# EAGLE schematic PastMontFIX (EAGLE 9.5.1)
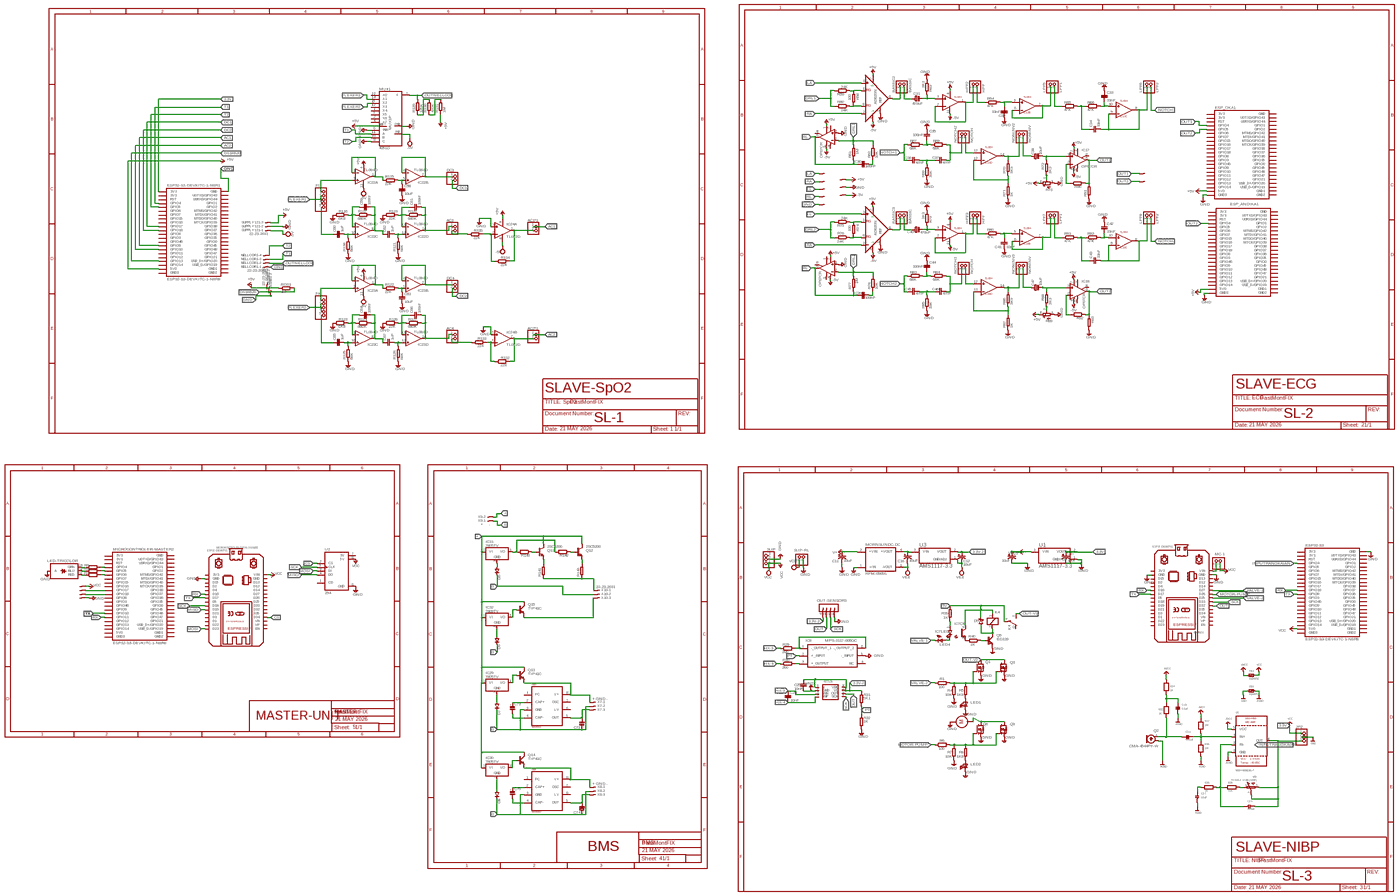
[diagram p0: schematic, sheet 1, overview]
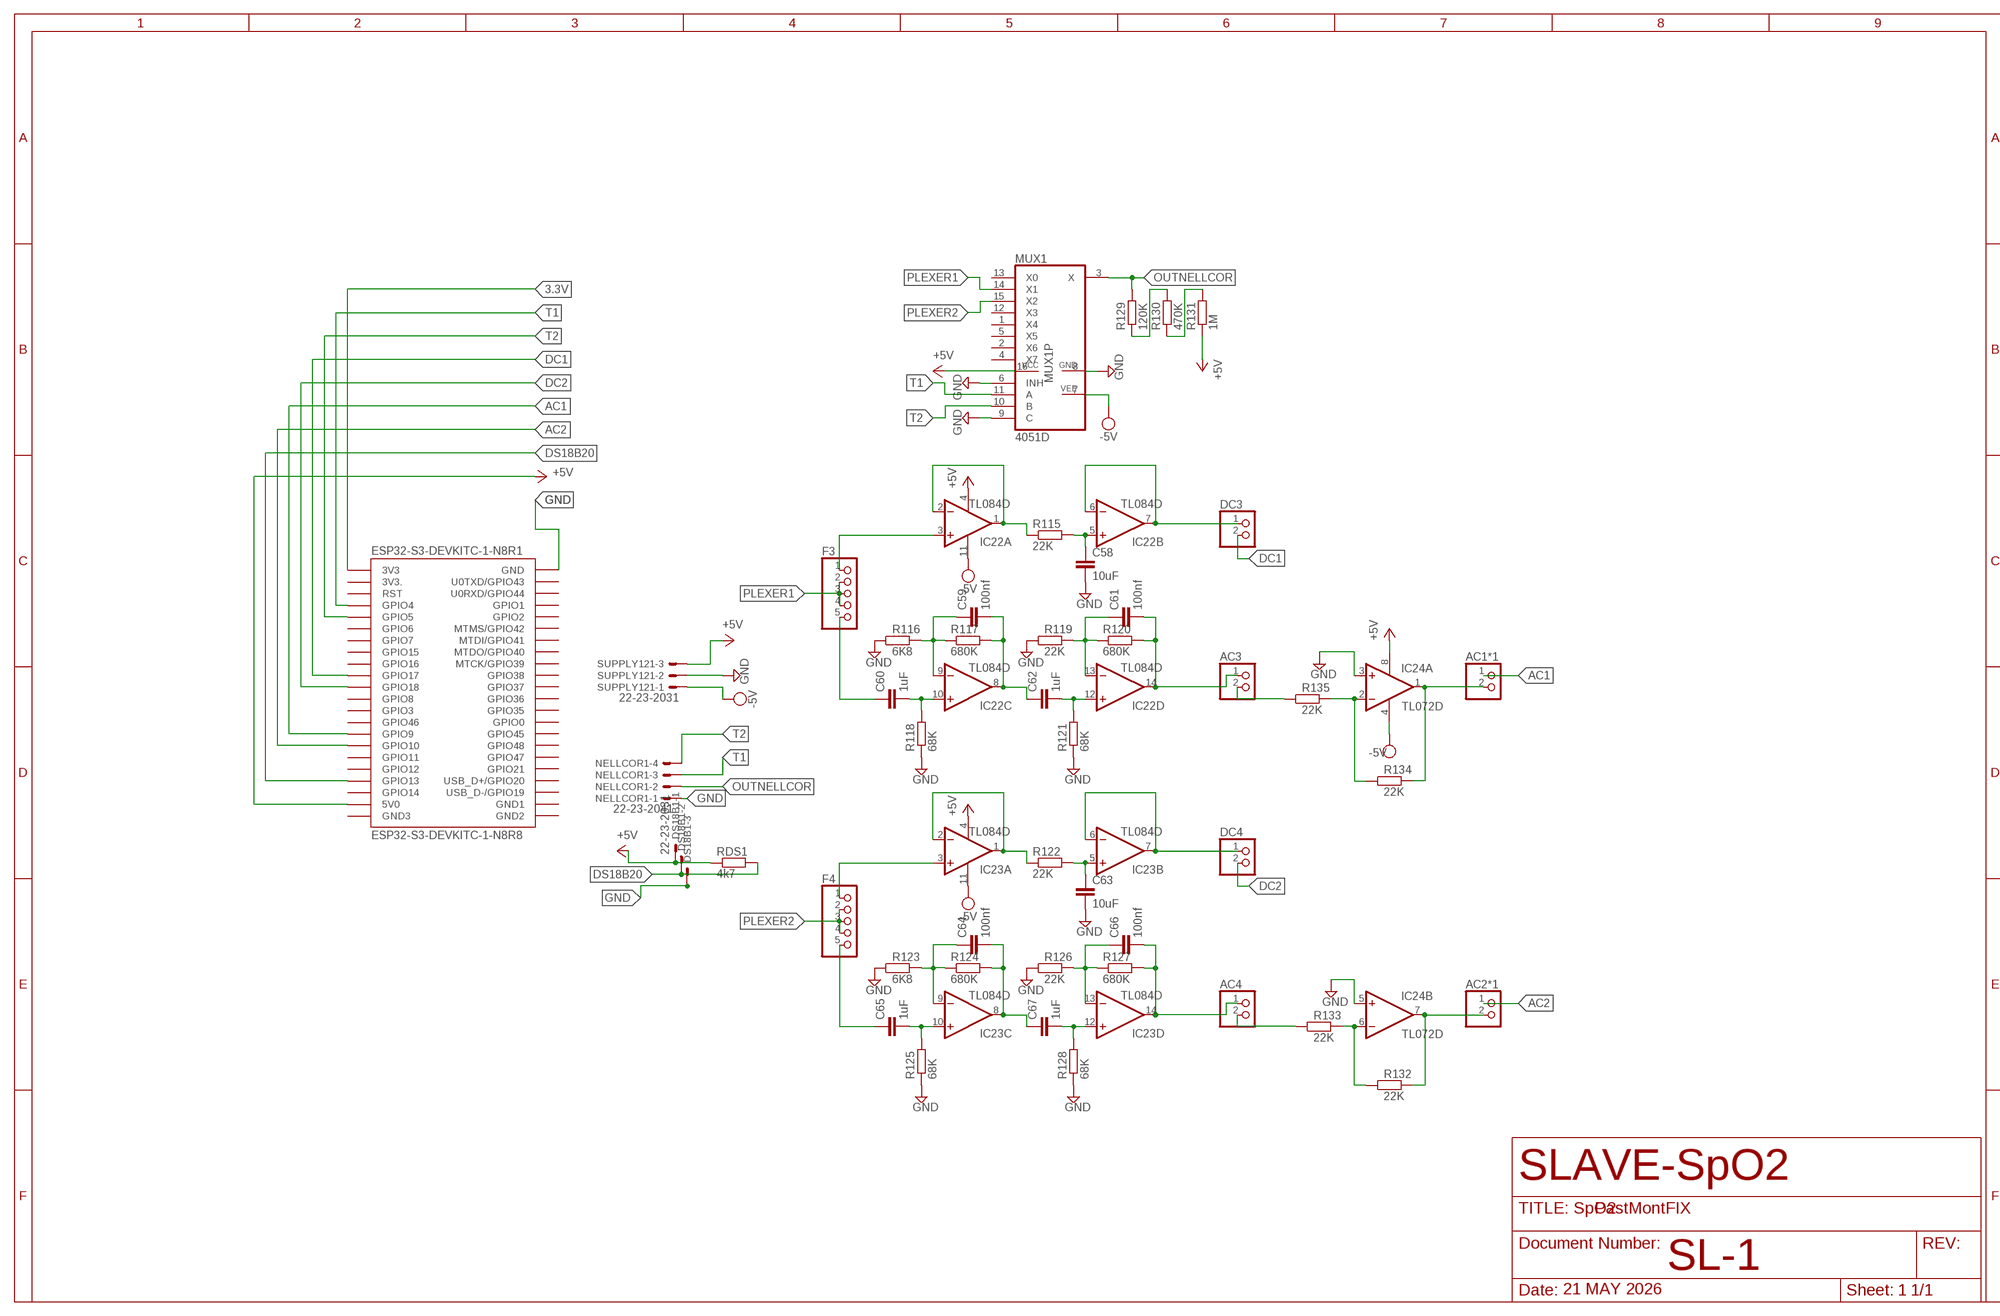
[diagram p1: schematic, sheet 1, part 1 of 4]
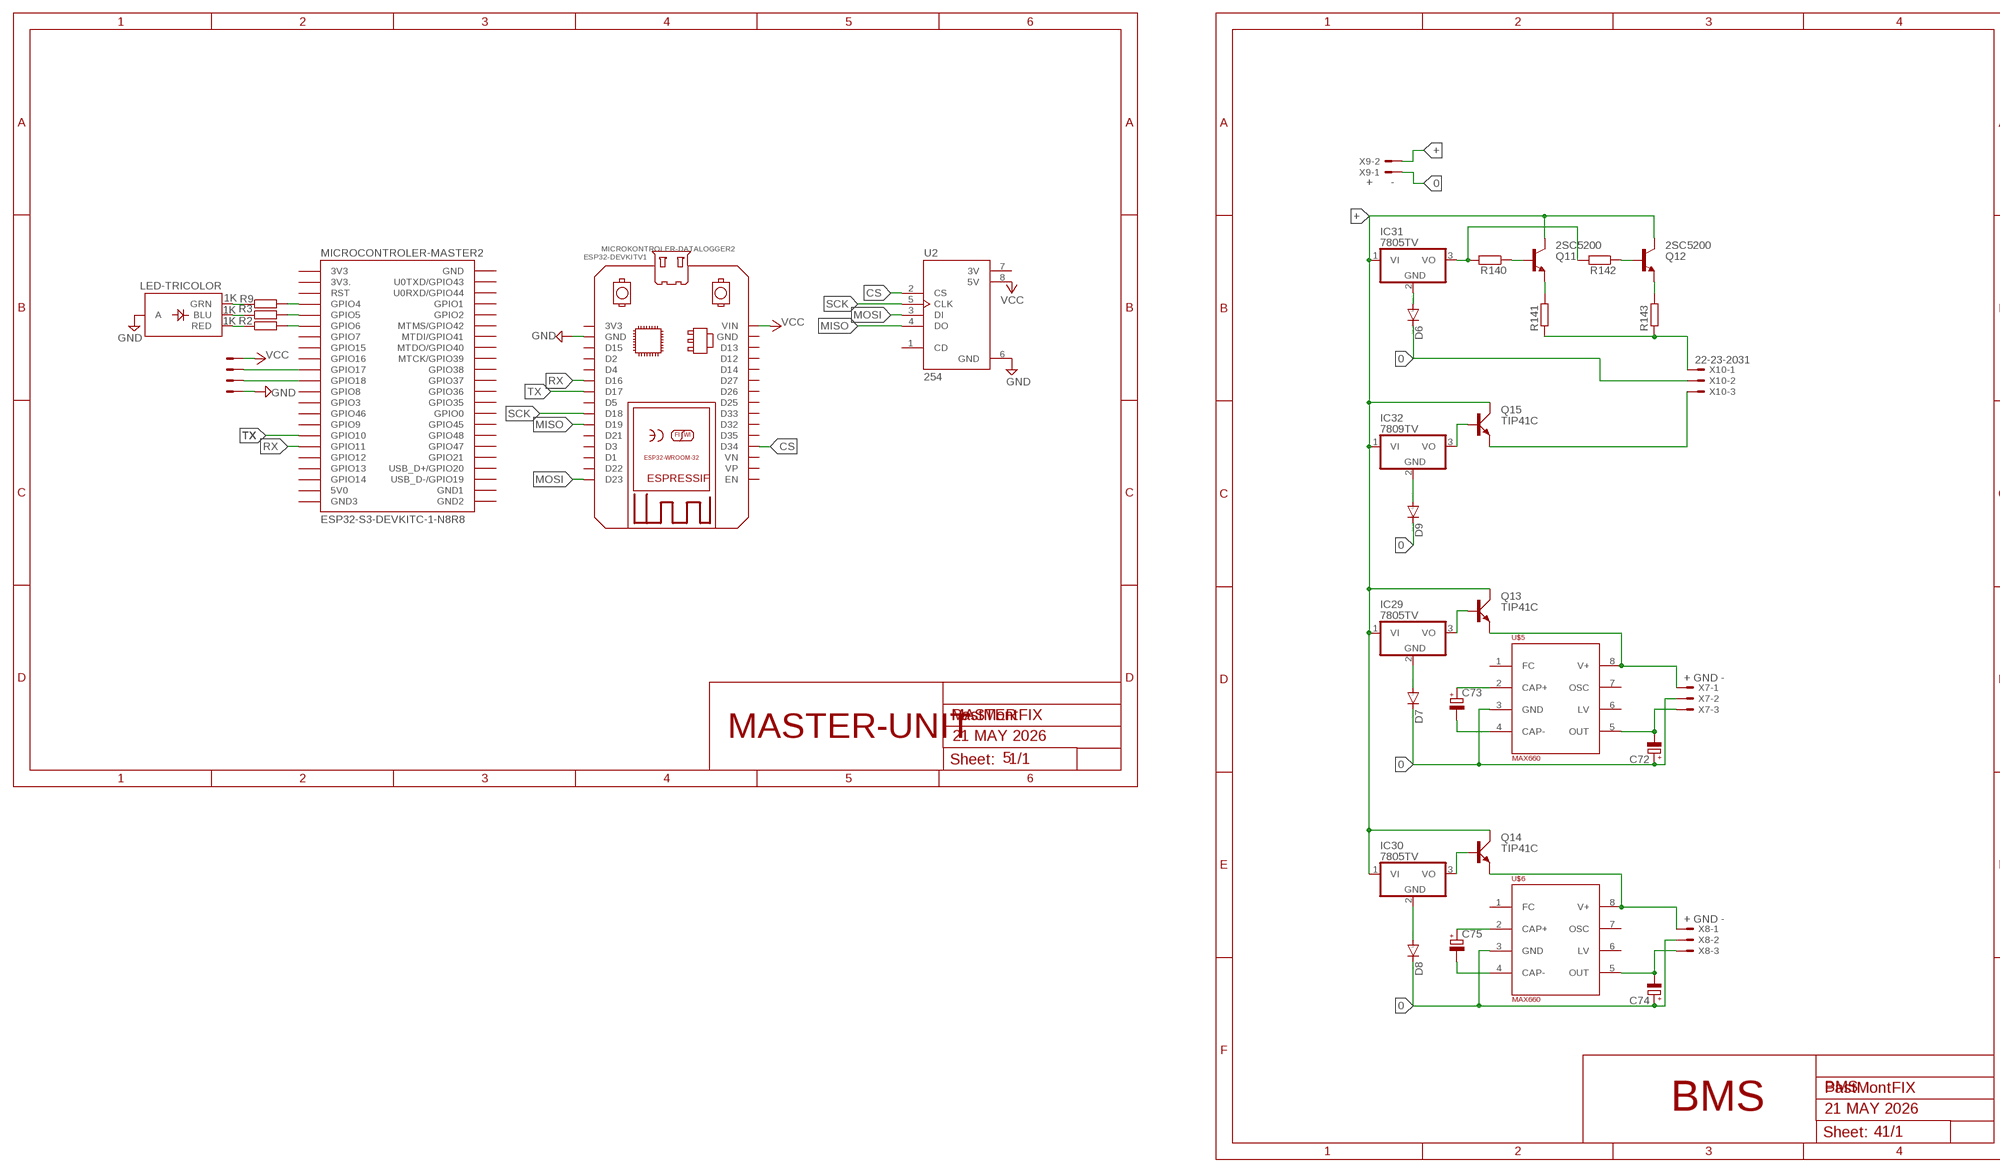
[diagram p2: schematic, sheet 1, part 2 of 4]
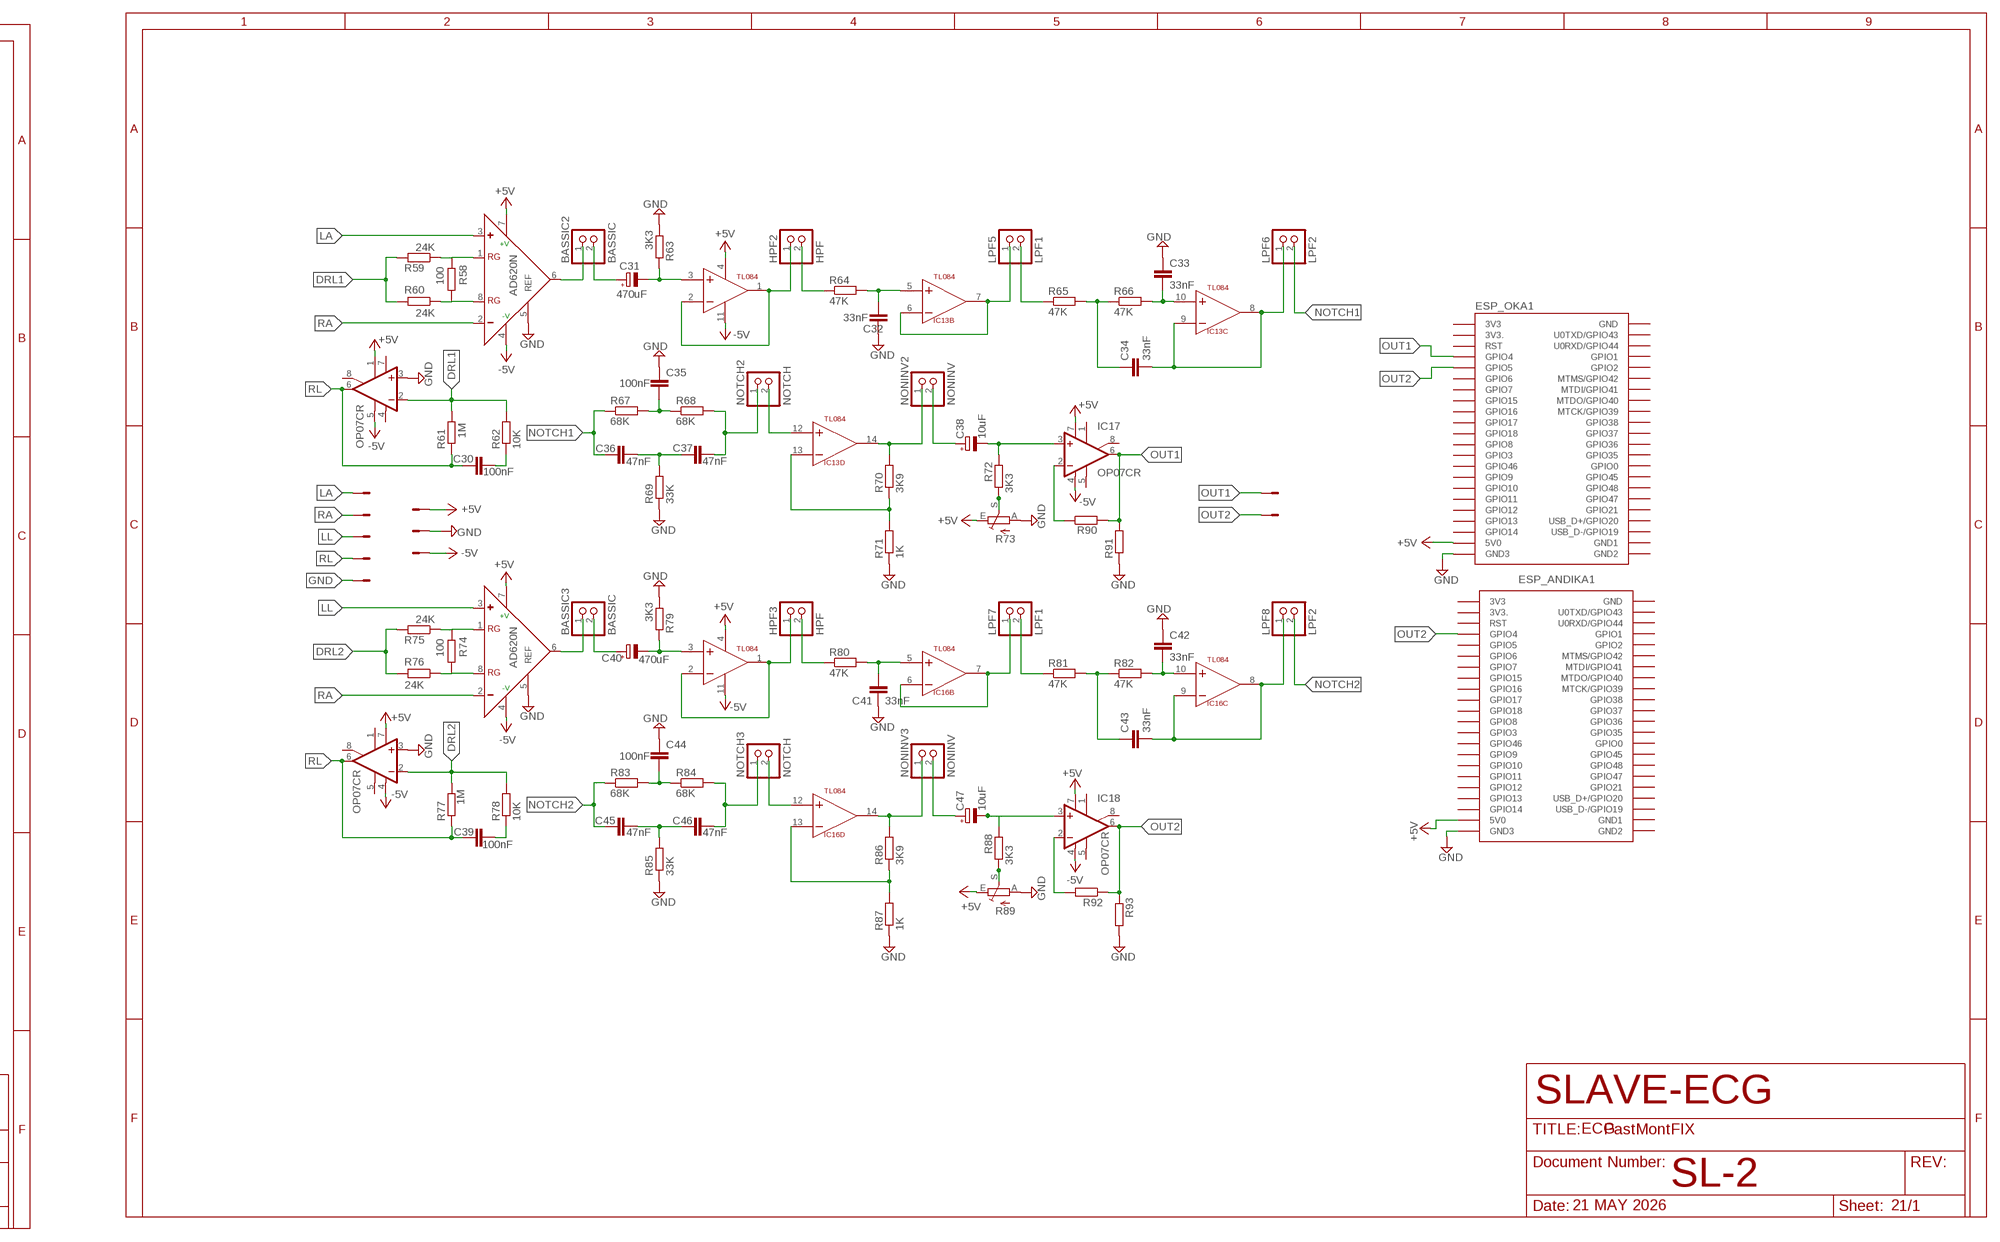
[diagram p3: schematic, sheet 1, part 3 of 4]
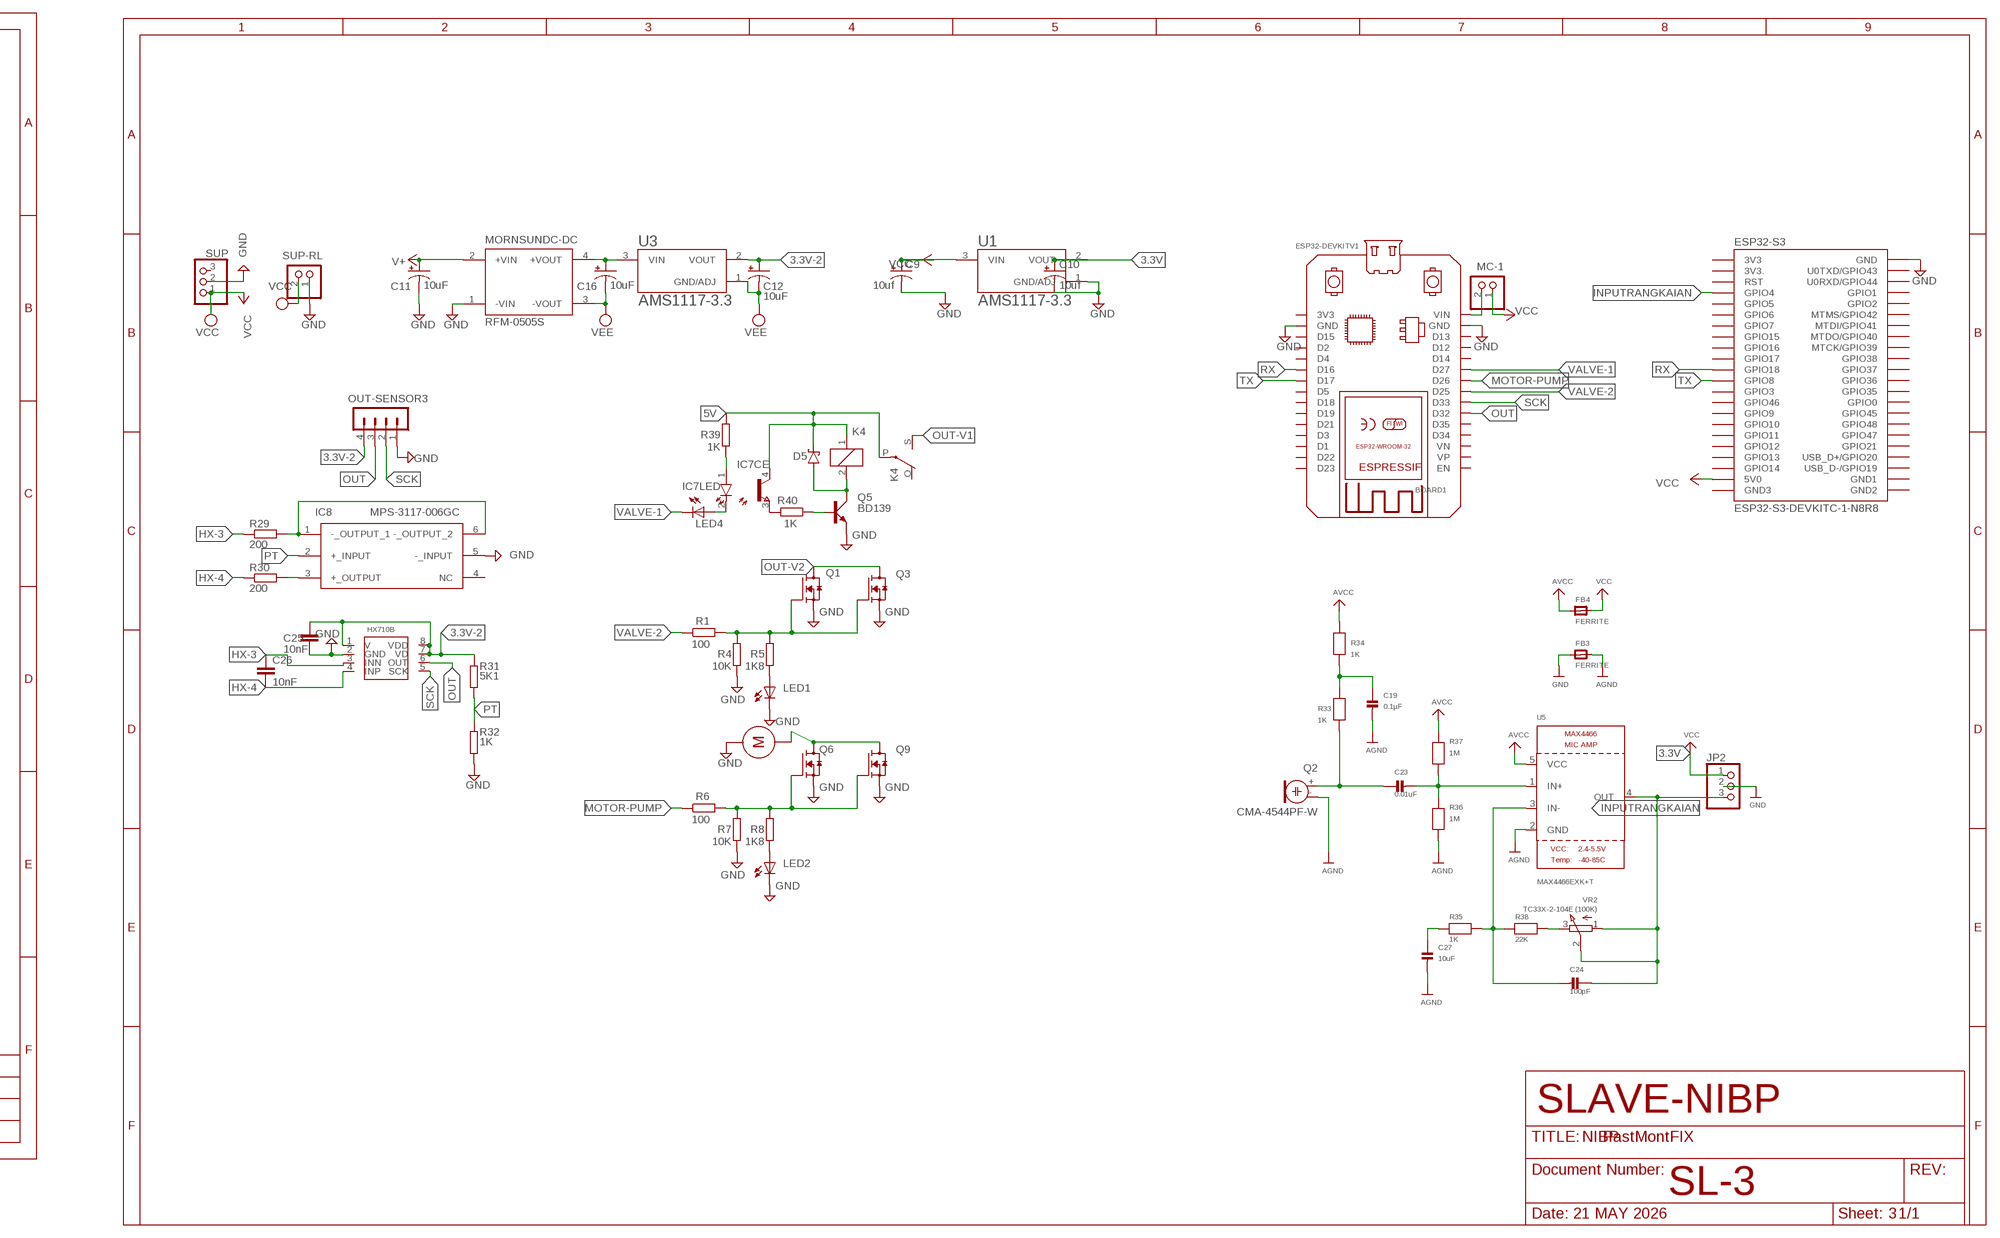
[diagram p4: schematic, sheet 1, part 4 of 4]

## Parts
AC1*1  PINHD-1X2  [1X02]
AC2*1  PINHD-1X2  [1X02]
AC3  PINHD-1X2  [1X02]
AC4  PINHD-1X2  [1X02]
BASSIC2  BASSIC  PINHD-1X2  [1X02]
BASSIC3  BASSIC  PINHD-1X2  [1X02]
BOARD1  ESP32DEVKITV1  [ESP32-DEVKITV1]
C9  10uf  CPOL-US150CLZ-0810  [150CLZ-0810]
C10  10uf  CPOL-US150CLZ-0810  [150CLZ-0810]
C11  10uF  CPOL-US150CLZ-1014  [150CLZ-1014]
C12  10uF  CPOL-US150CLZ-1014  [150CLZ-1014]
C16  10uF  CPOL-US150CLZ-1014  [150CLZ-1014]
C19  0.1µF  CAP_CERAMIC0805  [0805]
C23  0.01uF  CAP_CERAMIC0805  [0805]
C24  100pF  CAP_CERAMIC0805  [0805]
C25  10nF  C-EUC1206  [C1206]
C26  10nF  C-EUC1206  [C1206]
C27  10uF  CAP_CERAMIC0805  [0805]
C30  100nF  C-EUC1206  [C1206]
C31  470uF  CPOL-EU150CLZ-1010  [150CLZ-1010]
C32  33nF  C-EUC1206  [C1206]
C33  33nF  C-EUC1206  [C1206]
C34  33nF  C-EUC1206  [C1206]
C35  100nF  C-EUC1206  [C1206]
C36  47nF  C-EUC1206  [C1206]
C37  47nF  C-EUC1206  [C1206]
C38  10uF  CPOL-EU150CLZ-0810  [150CLZ-0810]
C39  100nF  C-EUC1206  [C1206]
C40  470uF  CPOL-EU150CLZ-1010  [150CLZ-1010]
C41  33nF  C-EUC1206  [C1206]
C42  33nF  C-EUC1206  [C1206]
C43  33nF  C-EUC1206  [C1206]
C44  100nF  C-EUC1206  [C1206]
C45  47nF  C-EUC1206  [C1206]
C46  47nF  C-EUC1206  [C1206]
C47  10uF  CPOL-EU150CLZ-0810  [150CLZ-0810]
C58  10uF  C-EUC1206  [C1206]
C59  100nf  C-EUC1206  [C1206]
C60  1uF  C-EUC1206  [C1206]
C61  100nf  C-EUC1206  [C1206]
C62  1uF  C-EUC1206  [C1206]
C63  10uF  C-EUC1206  [C1206]
C64  100nf  C-EUC1206  [C1206]
C65  1uF  C-EUC1206  [C1206]
C66  100nf  C-EUC1206  [C1206]
C67  1uF  C-EUC1206  [C1206]
C72  CPOL-EU150CLZ-0810  [150CLZ-0810]
C73  CPOL-EU150CLZ-0810  [150CLZ-0810]
C74  CPOL-EU150CLZ-0810  [150CLZ-0810]
C75  CPOL-EU150CLZ-0810  [150CLZ-0810]
D5  MBRS130LT3  [SMB]
D6  DIODE-DO41-7.6  [DO41-7.6]
D7  DIODE-DO41-7.6  [DO41-7.6]
D8  DIODE-DO41-7.6  [DO41-7.6]
D9  DIODE-DO41-7.6  [DO41-7.6]
DC3  PINHD-1X2  [1X02]
DC4  PINHD-1X2  [1X02]
DS18B1  22-23-2031  [22-23-2031]
ESP32-S3  ESP32-S3-DEVKITC-1-N8R8  [ESP32-S3-DEVKITC-1-N8R8]
ESP32-S3-DEVKITC-1-N8R1  ESP32-S3-DEVKITC-1-N8R8  [ESP32-S3-DEVKITC-1-N8R8]
ESP_ANDIKA1  ESP32-S3-DEVKITC-1-N8R8  [ESP32-S3-DEVKITC-1-N8R8]
ESP_OKA1  EWE  ESP32-S3-DEVKITC-1-N8R8  [ESP32-S3-DEVKITC-1-N8R8]
F3  PINHD-1X5  [1X05]
F4  PINHD-1X5  [1X05]
FB3  FERRITE  FERRITE0805  [0805]
FB4  FERRITE  FERRITE0805  [0805]
HPF2  HPF  PINHD-1X2  [1X02]
HPF3  HPF  PINHD-1X2  [1X02]
HX710B  HX710B  [SOP-8]
IC7  SFH6156  [SFH]
IC8  MPS-3117-006GC  [MPS3117006GC]
IC11  AD620N  [DIL08]
IC12  OP07CR  [SO08]
IC13  TL084  [SO14]
IC14  AD620N  [DIL08]
IC15  OP07CR  [SO08]
IC16  TL084  [SO14]
IC17  OP07CR  [SO08]
IC18  OP07CR  [SO08]
IC22  TL084D  [SO14]
IC23  TL084D  [SO14]
IC24  TL072D  [SO08]
IC29  7805TV  [TO220V]
IC30  7805TV  [TO220V]
IC31  7805TV  [TO220V]
IC32  7809TV  7805TV  [TO220V]
JP2  HEADER-1X376MIL  [1X03_ROUND_76]
K4  ZF112  [ZF112]
LED1  LEDCHIPLED_1206  [CHIPLED_1206]
LED2  LEDCHIPLED_1206  [CHIPLED_1206]
LED4  LEDCHIPLED_1206  [CHIPLED_1206]
LPF5  LPF1  PINHD-1X2  [1X02]
LPF6  LPF2  PINHD-1X2  [1X02]
LPF7  LPF1  PINHD-1X2  [1X02]
LPF8  LPF2  PINHD-1X2  [1X02]
M1  308-100  [308-100]
MC-1  PINHD-1X2  [1X02]
MICROCONTROLER-MASTER2  ESP32-S3-DEVKITC-1-N8R8  [ESP32-S3-DEVKITC-1-N8R8]
MICROKONTROLER-DATALOGGER2  ESP32DEVKITV1  [ESP32-DEVKITV1]
MORNSUNDC-DC  RFM-0505S  [CONV_RFM-0505S]
MUX1  4051D  [SO16]
NELLCOR1  22-23-2041  [22-23-2041]
NEX  22-23-2041  [22-23-2041]
NONINV2  NONINV  PINHD-1X2  [1X02]
NONINV3  NONINV  PINHD-1X2  [1X02]
NOTCH2  NOTCH  PINHD-1X2  [1X02]
NOTCH3  NOTCH  PINHD-1X2  [1X02]
OUT1  22-23-2021  [22-23-2021]
OUT-SENSOR3  MA04-1  [MA04-1]
POWER1  22-23-2031  [22-23-2031]
Q1  AOD4184A  [DPAK228P994X240-4N]
Q2  CMA-4544PF-W  ELECTRET  [ELECTRET_9.7]
Q3  AOD4184A  [DPAK228P994X240-4N]
Q5  BD139  [TO126AV]
Q6  AOD4184A  [DPAK228P994X240-4N]
Q9  AOD4184A  [DPAK228P994X240-4N]
Q11  2SC5200  [TO545P2020X520X2910-3]
Q12  2SC5200  [TO545P2020X520X2910-3]
Q13  TIP41C  [TO220AV]
Q14  TIP41C  [TO220AV]
Q15  TIP41C  [TO220AV]
R1  100  R-EU_M1206  [M1206]
R2  1K  R-EU_M1206  [M1206]
R3  1K  R-EU_M1206  [M1206]
R4  10K  R-EU_M1206  [M1206]
R5  1K8  R-EU_M1206  [M1206]
R6  100  R-EU_M1206  [M1206]
R7  10K  R-EU_M1206  [M1206]
R8  1K8  R-EU_M1206  [M1206]
R9  1K  R-EU_M1206  [M1206]
R29  200  R-EU_M1206  [M1206]
R30  200  R-EU_M1206  [M1206]
R31  5K1  R-EU_M1206  [M1206]
R32  1K  R-EU_M1206  [M1206]
R33  1K  RESISTOR0805  [0805]
R34  1K  RESISTOR0805  [0805]
R35  1K  RESISTOR0805  [0805]
R36  1M  RESISTOR0805  [0805]
R37  1M  RESISTOR0805  [0805]
R38  22K  RESISTOR0805  [0805]
R39  1K  R-EU_M1206  [M1206]
R40  1K  R-EU_M1206  [M1206]
R58  100  R-EU_R1206  [R1206]
R59  24K  R-EU_R1206  [R1206]
R60  24K  R-EU_R1206  [R1206]
R61  1M  R-EU_R1206  [R1206]
R62  10K  R-EU_R1206  [R1206]
R63  3K3  R-EU_R1206  [R1206]
R64  47K  R-EU_R1206  [R1206]
R65  47K  R-EU_R1206  [R1206]
R66  47K  R-EU_R1206  [R1206]
R67  68K  R-EU_R1206  [R1206]
R68  68K  R-EU_R1206  [R1206]
R69  33K  R-EU_R1206  [R1206]
R70  3K9  R-EU_R1206  [R1206]
R71  1K  R-EU_R1206  [R1206]
R72  3K3  R-EU_R1206  [R1206]
R73  TRIM_EU-CA6V  [CA6V]
R74  100  R-EU_R1206  [R1206]
R75  24K  R-EU_R1206  [R1206]
R76  24K  R-EU_R1206  [R1206]
R77  1M  R-EU_R1206  [R1206]
R78  10K  R-EU_R1206  [R1206]
R79  3K3  R-EU_R1206  [R1206]
R80  47K  R-EU_R1206  [R1206]
R81  47K  R-EU_R1206  [R1206]
R82  47K  R-EU_R1206  [R1206]
R83  68K  R-EU_R1206  [R1206]
R84  68K  R-EU_R1206  [R1206]
R85  33K  R-EU_R1206  [R1206]
R86  3K9  R-EU_R1206  [R1206]
R87  1K  R-EU_R1206  [R1206]
R88  3K3  R-EU_R1206  [R1206]
R89  TRIM_EU-CA6V  [CA6V]
R90  R-EU_R1206  [R1206]
R91  R-EU_R1206  [R1206]
R92  R-EU_R1206  [R1206]
R93  R-EU_R1206  [R1206]
R115  22K  R-EU_R1206  [R1206]
R116  6K8  R-EU_R1206  [R1206]
R117  680K  R-EU_R1206  [R1206]
R118  68K  R-EU_R1206  [R1206]
R119  22K  R-EU_R1206  [R1206]
R120  680K  R-EU_R1206  [R1206]
R121  68K  R-EU_R1206  [R1206]
R122  22K  R-EU_R1206  [R1206]
R123  6K8  R-EU_R1206  [R1206]
R124  680K  R-EU_R1206  [R1206]
R125  68K  R-EU_R1206  [R1206]
R126  22K  R-EU_R1206  [R1206]
R127  680K  R-EU_R1206  [R1206]
R128  68K  R-EU_R1206  [R1206]
R129  120K  R-EU_R1206  [R1206]
R130  470K  R-EU_R1206  [R1206]
R131  1M  R-EU_R1206  [R1206]
R132  22K  R-EU_R1206  [R1206]
R133  22K  R-EU_R1206  [R1206]
R134  22K  R-EU_R1206  [R1206]
R135  22K  R-EU_R1206  [R1206]
R140  R-EU_0617/17  [0617/17]
R141  R-EU_0922/22  [0922/22]
R142  R-EU_0617/17  [0617/17]
R143  R-EU_0922/22  [0922/22]
RDS1  4k7  R-EU_R1206  [R1206]
SUP  PINHD-1X3  [1X03]
SUP-RL  PINHD-1X2  [1X02]
SUPPLY121  22-23-2031  [22-23-2031]
U1  AMS1117-3.3  [SOT229P700X180-4N]
U2  254  [MODULE_254]
U3  AMS1117-3.3  [SOT229P700X180-4N]
U5  MAX4466EXK+T  MAX4466""  [SC70-5]
U$2  LED-TRICOLOR  [LED-TRICOLOR-SMD]
U$5  MAX660  [SO08]
U$6  MAX660  [SO08]
VR2  TC33X-2-104E (100K)  TRIMPOTTC33X-2  [TRIMPOT_BOURNS_TC33X-2]
X2  22-23-2051  [22-23-2051]
X7  + GND -  22-23-2031  [22-23-2031]
X8  + GND -  22-23-2031  [22-23-2031]
X9  + -  22-23-2021  [22-23-2021]
X10  22-23-2031  [22-23-2031]

## Nets
0: C72.+ C74.+ D6.C D7.C D8.C D9.C U$5.3(GND) U$6.3(GND) X7.2 X8.2 X9.1 X10.2
3.3V: C10.+ ESP32-S3-DEVKITC-1-N8R1.J1_1(3V3) JP2.1 U1.2(VOUT) ; supply symbol labelled VCC
3.3V-2: C12.+ C25.1 HX710B.1(V) HX710B.7(VD) HX710B.8(VDD) OUT-SENSOR3.4 R31.1 U3.2(VOUT)
5V: D5.C IC7.4(CE:C) K4.1 K4.P(2:P) R39.2
+: IC29.1(VI) IC30.1(VI) IC31.1(VI) IC32.1(VI) Q11.2(C) Q12.2(C) Q13.C Q14.C Q15.C X9.2
+5V: ESP_ANDIKA1.J1_21(5V0) ESP_OKA1.J1_21(5V0) IC11.4(-V) IC11.7(+V) IC12.1(ON1) IC12.5(OPT) IC13.4(PWR:VCC+) IC13.11(PWR:VCC-) IC14.4(-V) IC14.7(+V) IC15.4(V-) IC15.7(V+) IC16.4(PWR:VCC+) IC16.11(PWR:VCC-) IC17.4(V-) IC17.7(V+) IC18.4(V-) IC18.7(V+) POWER1.1 POWER1.3 R73.E R89.E ; supply symbol labelled -5V
AC1: AC1*1.1 ESP32-S3-DEVKITC-1-N8R1.J1_15(GPIO9)
AC2: AC2*1.1 ESP32-S3-DEVKITC-1-N8R1.J1_16(GPIO10)
AGND: C19.2 C27.2 FB3.2 Q2.- R36.1 U5.2(GND)
AVCC: FB4.1 R34.2 R37.2 U5.5(VCC)
CS: MICROKONTROLER-DATALOGGER2.D34 U2.2(CS)
DC1: DC3.2 ESP32-S3-DEVKITC-1-N8R1.J1_10(GPIO17)
DC2: DC4.2 ESP32-S3-DEVKITC-1-N8R1.J1_11(GPIO18)
DRL1: IC12.2(-IN) R59.2 R60.2 R61.2 R62.2
DRL2: IC15.2(-IN) R75.2 R76.2 R77.2 R78.2
DS18B20: DS18B1.2 ESP32-S3-DEVKITC-1-N8R1.J1_19(GPIO13) RDS1.2
GND: BOARD1.GND BOARD1.GND@1(GND) C9.- C10.- C11.- C25.2 C32.2 C33.1 C35.1 C41.2 C42.1 C44.1 C58.2 C63.2 DS18B1.3 ESP32-S3-DEVKITC-1-N8R1.J3_1(GND) ESP32-S3.J3_1(GND) ESP_ANDIKA1.J1_22(GND3) ESP_OKA1.J1_22(GND3) FB3.1 HX710B.2(GND) IC8.5(-_INPUT) IC11.5(REF) IC12.3(+IN) IC14.5(REF) IC15.3(+IN) IC24.3(A:+IN) IC24.5(B:+IN) JP2.2 LED1.C LED2.C M1.NEG MICROKONTROLER-DATALOGGER2.GND@1(GND) MORNSUNDC-DC.1(-VIN) MUX1.6(INH) MUX1.8(GND) MUX1.9(C) NELLCOR1.1 NEX.4 OUT-SENSOR3.1 POWER1.2 Q1.3(S) Q3.3(S) Q5.E Q6.3(S) Q9.3(S) R4.1 R7.1 R32.2 R63.1 R69.1 R71.1 R73.A R79.1 R85.1 R87.1 R89.A R91.1 R93.2 R116.1 R118.1 R119.1 R121.1 R123.1 R125.1 R126.1 R128.1 SUP-RL.1 SUP.2 SUPPLY121.2 U1.1(GND/ADJ) U2.6(GND) U$2.A X2.5
HX-3: C26.1 HX710B.3(INN) R29.1
HX-4: C26.2 HX710B.4(INP) R30.1
INPUTRANGKAIAN: C24.1 ESP32-S3.J1_4(GPIO4) JP2.3 U5.4(OUT) VR2.1(A) VR2.2(S)
LA: IC11.3(+) X2.1
LL: IC14.3(+) X2.3
MISO: MICROKONTROLER-DATALOGGER2.D19 U2.4(DO)
MOSI: MICROKONTROLER-DATALOGGER2.D23 U2.3(DI)
MOTOR-PUMP: BOARD1.D26 R6.1
N$1: LED1.A R5.1
N$2: C16.+ MORNSUNDC-DC.4(+VOUT) U3.3(VIN)
N$3: Q1.1(G) Q3.1(G) R1.2 R4.2 R5.2
N$4: LED2.A R8.1
N$5: Q6.1(G) Q9.1(G) R6.2 R7.2 R8.2
N$7: R9.1 U$2.G(GRN)
N$8: R3.1 U$2.B(BLU)
N$9: R2.1 U$2.R(RED)
N$10: MICROCONTROLER-MASTER2.J1_6(GPIO6) R2.2
N$11: MICROCONTROLER-MASTER2.J1_5(GPIO5) R3.2
N$12: BOARD1.VIN MC-1.2
N$13: MICROCONTROLER-MASTER2.J1_4(GPIO4) R9.2
N$23: MICROCONTROLER-MASTER2.J1_10(GPIO17) NEX.2
N$24: MICROCONTROLER-MASTER2.J1_11(GPIO18) NEX.3
N$25: IC8.1(-_OUTPUT_1) IC8.6(-_OUTPUT_2) R29.2
N$26: IC8.3(+_OUTPUT) R30.2
N$28: C23.1 Q2.+ R33.1
N$29: C19.1 R33.2 R34.1
N$30: C23.2 R36.2 R37.1 U5.1(IN+)
N$32: C24.2 R35.2 R38.1 U5.3(IN-)
N$33: C27.1 R35.1
N$34: R38.2 VR2.3(E)
N$47: Q5.B R40.1
N$48: D5.A K4.2 Q5.C
N$49: IC7.2(LED:K) LED4.A
N$50: IC7.1(LED:A) R39.1
N$51: IC7.3(CE:E) R40.2
N$77: IC11.8(RG) R58.1 R60.1
N$78: IC11.1(RG) R58.2 R59.1
N$79: BASSIC2.1 IC11.6(OUT)
N$80: BASSIC2.2 C31.+
N$81: C31.- IC13.3(A:IN+) R63.2
N$82: HPF2.1 IC13.1(A:OUT) IC13.2(A:IN-)
N$83: C32.1 IC13.5(B:IN+) R64.2
N$84: IC13.6(B:IN-) IC13.7(B:OUT) LPF5.1
N$85: C34.1 R65.2 R66.1
N$86: C33.2 IC13.10(C:IN+) R66.2
N$87: C34.2 IC13.8(C:OUT) IC13.9(C:IN-) LPF6.1
N$88: C35.2 R67.2 R68.1
N$89: C36.2 C37.1 R69.2
N$90: C37.2 NOTCH2.1 R68.2
N$91: HPF2.2 R64.1
N$92: LPF5.2 R65.1
N$93: IC13.14(D:OUT) NONINV2.1 R70.2
N$94: IC13.13(D:IN-) R70.1 R71.2
N$95: C38.+ NONINV2.2
N$96: R72.1 R73.S
N$97: IC13.12(D:IN+) NOTCH2.2
N$98: C30.2 R62.1
N$99: IC14.8(RG) R74.1 R76.1
N$100: IC14.1(RG) R74.2 R75.1
N$101: BASSIC3.1 IC14.6(OUT)
N$102: BASSIC3.2 C40.+
N$103: C40.- IC16.3(A:IN+) R79.2
N$104: HPF3.1 IC16.1(A:OUT) IC16.2(A:IN-)
N$105: C41.1 IC16.5(B:IN+) R80.2
N$106: IC16.6(B:IN-) IC16.7(B:OUT) LPF7.1
N$107: C43.1 R81.2 R82.1
N$108: C42.2 IC16.10(C:IN+) R82.2
N$109: C43.2 IC16.8(C:OUT) IC16.9(C:IN-) LPF8.1
N$110: C44.2 R83.2 R84.1
N$111: C45.2 C46.1 R85.2
N$112: C46.2 NOTCH3.1 R84.2
N$113: HPF3.2 R80.1
N$114: LPF7.2 R81.1
N$115: IC16.14(D:OUT) NONINV3.1 R86.2
N$116: IC16.13(D:IN-) R86.1 R87.2
N$117: C47.+ NONINV3.2
N$118: R88.1 R89.S
N$119: IC16.12(D:IN+) NOTCH3.2
N$120: C39.2 R78.1
N$121: IC17.2(-IN) R90.1
N$122: IC18.2(-IN) R92.2
N$123: C47.- IC18.3(+IN) R88.2
N$124: C38.- IC17.3(+IN) R72.2
N$155: IC22.1(A:OUT) IC22.2(A:-IN) R115.1
N$156: DC3.1 IC22.6(B:-IN) IC22.7(B:OUT)
N$157: C58.1 IC22.5(B:+IN) R115.2
N$158: C59.2 C62.1 IC22.8(C:OUT) R117.2
N$159: C59.1 IC22.9(C:-IN) R116.2 R117.1
N$160: C60.2 IC22.10(C:+IN) R118.2
N$161: C62.2 IC22.12(D:+IN) R121.2
N$162: C61.1 IC22.13(D:-IN) R119.2 R120.1
N$163: AC3.1 C61.2 IC22.14(D:OUT) R120.2
N$164: F3.1 IC22.3(A:+IN)
N$165: C60.1 F3.5
N$166: IC23.1(A:OUT) IC23.2(A:-IN) R122.1
N$167: DC4.1 IC23.6(B:-IN) IC23.7(B:OUT)
N$168: C63.1 IC23.5(B:+IN) R122.2
N$169: C64.2 C67.1 IC23.8(C:OUT) R124.2
N$170: C64.1 IC23.9(C:-IN) R123.2 R124.1
N$171: C65.2 IC23.10(C:+IN) R125.2
N$172: C67.2 IC23.12(D:+IN) R128.2
N$173: C66.1 IC23.13(D:-IN) R126.2 R127.1
N$174: AC4.1 C66.2 IC23.14(D:OUT) R127.2
N$175: F4.1 IC23.3(A:+IN)
N$176: C65.1 F4.5
N$177: R129.1 R130.2
N$178: R130.1 R131.2
N$179: IC24.2(A:-IN) R134.1 R135.2
N$180: AC1*1.2 IC24.1(A:OUT) R134.2
N$181: AC2*1.2 IC24.7(B:OUT) R132.2
N$182: IC24.6(B:-IN) R132.1 R133.2
N$183: AC3.2 R135.1
N$184: AC4.2 R133.1
N$207: C73.+ U$5.2(CAP+)
N$208: C73.- U$5.4(CAP-)
N$209: C72.- U$5.5(OUT) X7.3
N$210: Q13.E U$5.8(V+) X7.1
N$211: C75.+ U$6.2(CAP+)
N$212: C75.- U$6.4(CAP-)
N$213: C74.- U$6.5(OUT) X8.3
N$214: Q14.E U$6.8(V+) X8.1
N$215: IC31.3(VO) R140.2 R142.2
N$216: Q11.1(B) R140.1
N$217: Q11.3(E) R141.2
N$218: Q12.1(B) R142.1
N$219: Q12.3(E) R143.2
N$220: R141.1 R143.1 X10.1
N$221: D6.A IC31.2(GND)
N$222: IC29.3(VO) Q13.B
N$223: IC30.3(VO) Q14.B
N$224: IC32.3(VO) Q15.B
N$225: D8.A IC30.2(GND)
N$226: D7.A IC29.2(GND)
N$227: D9.A IC32.2(GND)
N$228: Q15.E X10.3
NOTCH1: C36.1 LPF6.2 R67.1
NOTCH2: C45.1 LPF8.2 R83.1
OUT: BOARD1.D32 HX710B.6(OUT) OUT-SENSOR3.3
OUT1: ESP_OKA1.J1_4(GPIO4) IC17.6(OUT) OUT1.1 R90.2 R91.2
OUT2: ESP_ANDIKA1.J1_4(GPIO4) ESP_OKA1.J1_5(GPIO5) IC18.6(OUT) OUT1.2 R92.1 R93.1
OUT-MP: M1.POS Q6.4(D) Q9.4(D)
OUT-V1: K4.S(2:S)
OUT-V2: Q1.4(D) Q3.4(D)
OUTNELLCOR: MUX1.3(X) NELLCOR1.2 R129.2
PLEXER1: F3.2 F3.3 F3.4 MUX1.14(X1)
PLEXER2: F4.2 F4.3 F4.4 MUX1.15(X2)
PT: IC8.2(+_INPUT) R31.2 R32.1
RA: IC11.2(-) IC14.2(-) X2.2
RL: C30.1 C39.1 IC12.6(OUT) IC15.6(OUT) R61.1 R77.1 X2.4
RX: BOARD1.D16 ESP32-S3.J1_11(GPIO18) MICROCONTROLER-MASTER2.J1_17(GPIO11) MICROKONTROLER-DATALOGGER2.D16
SCK: BOARD1.D33 HX710B.5(SCK) MICROKONTROLER-DATALOGGER2.D18 OUT-SENSOR3.2 U2.5(CLK)
T1: ESP32-S3-DEVKITC-1-N8R1.J1_4(GPIO4) MUX1.11(A) NELLCOR1.3
T2: ESP32-S3-DEVKITC-1-N8R1.J1_5(GPIO5) MUX1.10(B) NELLCOR1.4
TX: BOARD1.D17 ESP32-S3.J1_12(GPIO8) MICROCONTROLER-MASTER2.J1_16(GPIO10) MICROKONTROLER-DATALOGGER2.D17
V+: C11.+ MORNSUNDC-DC.2(+VIN)
VALVE-1: BOARD1.D27 LED4.C
VALVE-2: BOARD1.D25 R1.1
VCC: C9.+ DS18B1.1 ESP32-S3-DEVKITC-1-N8R1.J1_21(5V0) ESP32-S3.J1_21(5V0) FB4.2 IC22.4(P:V+) IC23.4(P:V+) IC24.8(P:V+) MC-1.1 MICROKONTROLER-DATALOGGER2.VIN MUX1.16(VCC) NEX.1 R131.1 RDS1.1 SUP-RL.2 SUP.1 SUPPLY121.3 U1.3(VIN) U2.8(5V) ; supply symbol labelled +5V
VEE: C12.- C16.- IC22.11(P:V-) IC23.11(P:V-) IC24.4(P:V-) MORNSUNDC-DC.3(-VOUT) MUX1.7(VEE) SUPPLY121.1 U3.1(GND/ADJ) ; supply symbol labelled -5V
Unconnected: BOARD1.3V3 BOARD1.D1 BOARD1.D2 BOARD1.D3 BOARD1.D4 BOARD1.D5 BOARD1.D12 BOARD1.D13 BOARD1.D14 BOARD1.D15 BOARD1.D18 BOARD1.D19 BOARD1.D21 BOARD1.D22 BOARD1.D23 BOARD1.D34 BOARD1.D35 BOARD1.EN BOARD1.VN BOARD1.VP ESP32-S3-DEVKITC-1-N8R1.J1_3(RST) ESP32-S3-DEVKITC-1-N8R1.J1_6(GPIO6) ESP32-S3-DEVKITC-1-N8R1.J1_7(GPIO7) ESP32-S3-DEVKITC-1-N8R1.J1_8(GPIO15) ESP32-S3-DEVKITC-1-N8R1.J1_9(GPIO16) ESP32-S3-DEVKITC-1-N8R1.J1_12(GPIO8) ESP32-S3-DEVKITC-1-N8R1.J1_13(GPIO3) ESP32-S3-DEVKITC-1-N8R1.J1_14(GPIO46) ESP32-S3-DEVKITC-1-N8R1.J1_17(GPIO11) ESP32-S3-DEVKITC-1-N8R1.J1_18(GPIO12) ESP32-S3-DEVKITC-1-N8R1.J1_20(GPIO14) ESP32-S3-DEVKITC-1-N8R1.J3_2(U0TXD/GPIO43) ESP32-S3-DEVKITC-1-N8R1.J3_3(U0RXD/GPIO44) ESP32-S3-DEVKITC-1-N8R1.J3_4(GPIO1) ESP32-S3-DEVKITC-1-N8R1.J3_5(GPIO2) ESP32-S3-DEVKITC-1-N8R1.J3_6(MTMS/GPIO42) ESP32-S3-DEVKITC-1-N8R1.J3_7(MTDI/GPIO41) ESP32-S3-DEVKITC-1-N8R1.J3_8(MTDO/GPIO40) ESP32-S3-DEVKITC-1-N8R1.J3_9(MTCK/GPIO39) ESP32-S3-DEVKITC-1-N8R1.J3_10(GPIO38) ESP32-S3-DEVKITC-1-N8R1.J3_11(GPIO37) ESP32-S3-DEVKITC-1-N8R1.J3_12(GPIO36) ESP32-S3-DEVKITC-1-N8R1.J3_13(GPIO35) ESP32-S3-DEVKITC-1-N8R1.J3_14(GPIO0) ESP32-S3-DEVKITC-1-N8R1.J3_15(GPIO45) ESP32-S3-DEVKITC-1-N8R1.J3_16(GPIO48) ESP32-S3-DEVKITC-1-N8R1.J3_17(GPIO47) ESP32-S3-DEVKITC-1-N8R1.J3_18(GPIO21) ESP32-S3-DEVKITC-1-N8R1.J3_19(USB_D+/GPIO20) ESP32-S3-DEVKITC-1-N8R1.J3_20(USB_D-/GPIO19) ESP32-S3.J1_3(RST) ESP32-S3.J1_5(GPIO5) ESP32-S3.J1_6(GPIO6) ESP32-S3.J1_7(GPIO7) ESP32-S3.J1_8(GPIO15) ESP32-S3.J1_9(GPIO16) ESP32-S3.J1_10(GPIO17) ESP32-S3.J1_13(GPIO3) ESP32-S3.J1_14(GPIO46) ESP32-S3.J1_15(GPIO9) ESP32-S3.J1_16(GPIO10) ESP32-S3.J1_17(GPIO11) ESP32-S3.J1_18(GPIO12) ESP32-S3.J1_19(GPIO13) ESP32-S3.J1_20(GPIO14) ESP32-S3.J3_2(U0TXD/GPIO43) ESP32-S3.J3_3(U0RXD/GPIO44) ESP32-S3.J3_4(GPIO1) ESP32-S3.J3_5(GPIO2) ESP32-S3.J3_6(MTMS/GPIO42) ESP32-S3.J3_7(MTDI/GPIO41) ESP32-S3.J3_8(MTDO/GPIO40) ESP32-S3.J3_9(MTCK/GPIO39) ESP32-S3.J3_10(GPIO38) ESP32-S3.J3_11(GPIO37) ESP32-S3.J3_12(GPIO36) ESP32-S3.J3_13(GPIO35) ESP32-S3.J3_14(GPIO0) ESP32-S3.J3_15(GPIO45) ESP32-S3.J3_16(GPIO48) ESP32-S3.J3_17(GPIO47) ESP32-S3.J3_18(GPIO21) ESP32-S3.J3_19(USB_D+/GPIO20) ESP32-S3.J3_20(USB_D-/GPIO19) ESP_ANDIKA1.J1_3(RST) ESP_ANDIKA1.J1_5(GPIO5) ESP_ANDIKA1.J1_6(GPIO6) ESP_ANDIKA1.J1_7(GPIO7) ESP_ANDIKA1.J1_8(GPIO15) ESP_ANDIKA1.J1_9(GPIO16) ESP_ANDIKA1.J1_10(GPIO17) ESP_ANDIKA1.J1_11(GPIO18) ESP_ANDIKA1.J1_12(GPIO8) ESP_ANDIKA1.J1_13(GPIO3) ESP_ANDIKA1.J1_14(GPIO46) ESP_ANDIKA1.J1_15(GPIO9) ESP_ANDIKA1.J1_16(GPIO10) ESP_ANDIKA1.J1_17(GPIO11) ESP_ANDIKA1.J1_18(GPIO12) ESP_ANDIKA1.J1_19(GPIO13) ESP_ANDIKA1.J1_20(GPIO14) ESP_ANDIKA1.J3_2(U0TXD/GPIO43) ESP_ANDIKA1.J3_3(U0RXD/GPIO44) ESP_ANDIKA1.J3_4(GPIO1) ESP_ANDIKA1.J3_5(GPIO2) ESP_ANDIKA1.J3_6(MTMS/GPIO42) ESP_ANDIKA1.J3_7(MTDI/GPIO41) ESP_ANDIKA1.J3_8(MTDO/GPIO40) ESP_ANDIKA1.J3_9(MTCK/GPIO39) ESP_ANDIKA1.J3_10(GPIO38) ESP_ANDIKA1.J3_11(GPIO37) ESP_ANDIKA1.J3_12(GPIO36) ESP_ANDIKA1.J3_13(GPIO35) ESP_ANDIKA1.J3_14(GPIO0) ESP_ANDIKA1.J3_15(GPIO45) ESP_ANDIKA1.J3_16(GPIO48) ESP_ANDIKA1.J3_17(GPIO47) ESP_ANDIKA1.J3_18(GPIO21) ESP_ANDIKA1.J3_19(USB_D+/GPIO20) ESP_ANDIKA1.J3_20(USB_D-/GPIO19) ESP_OKA1.J1_3(RST) ESP_OKA1.J1_6(GPIO6) ESP_OKA1.J1_7(GPIO7) ESP_OKA1.J1_8(GPIO15) ESP_OKA1.J1_9(GPIO16) ESP_OKA1.J1_10(GPIO17) ESP_OKA1.J1_11(GPIO18) ESP_OKA1.J1_12(GPIO8) ESP_OKA1.J1_13(GPIO3) ESP_OKA1.J1_14(GPIO46) ESP_OKA1.J1_15(GPIO9) ESP_OKA1.J1_16(GPIO10) ESP_OKA1.J1_17(GPIO11) ESP_OKA1.J1_18(GPIO12) ESP_OKA1.J1_19(GPIO13) ESP_OKA1.J1_20(GPIO14) ESP_OKA1.J3_2(U0TXD/GPIO43) ESP_OKA1.J3_3(U0RXD/GPIO44) ESP_OKA1.J3_4(GPIO1) ESP_OKA1.J3_5(GPIO2) ESP_OKA1.J3_6(MTMS/GPIO42) ESP_OKA1.J3_7(MTDI/GPIO41) ESP_OKA1.J3_8(MTDO/GPIO40) ESP_OKA1.J3_9(MTCK/GPIO39) ESP_OKA1.J3_10(GPIO38) ESP_OKA1.J3_11(GPIO37) ESP_OKA1.J3_12(GPIO36) ESP_OKA1.J3_13(GPIO35) ESP_OKA1.J3_14(GPIO0) ESP_OKA1.J3_15(GPIO45) ESP_OKA1.J3_16(GPIO48) ESP_OKA1.J3_17(GPIO47) ESP_OKA1.J3_18(GPIO21) ESP_OKA1.J3_19(USB_D+/GPIO20) ESP_OKA1.J3_20(USB_D-/GPIO19) IC8.4(NC) IC12.8(ON2) IC15.1(ON1) IC15.5(OPT) IC15.8(ON2) IC17.1(ON1) IC17.5(OPT) IC17.8(ON2) IC18.1(ON1) IC18.5(OPT) IC18.8(ON2) K4.O(2:O) MICROCONTROLER-MASTER2.J1_3(RST) MICROCONTROLER-MASTER2.J1_7(GPIO7) MICROCONTROLER-MASTER2.J1_8(GPIO15) MICROCONTROLER-MASTER2.J1_9(GPIO16) MICROCONTROLER-MASTER2.J1_12(GPIO8) MICROCONTROLER-MASTER2.J1_13(GPIO3) MICROCONTROLER-MASTER2.J1_14(GPIO46) MICROCONTROLER-MASTER2.J1_15(GPIO9) MICROCONTROLER-MASTER2.J1_18(GPIO12) MICROCONTROLER-MASTER2.J1_19(GPIO13) MICROCONTROLER-MASTER2.J1_20(GPIO14) MICROCONTROLER-MASTER2.J3_2(U0TXD/GPIO43) MICROCONTROLER-MASTER2.J3_3(U0RXD/GPIO44) MICROCONTROLER-MASTER2.J3_4(GPIO1) MICROCONTROLER-MASTER2.J3_5(GPIO2) MICROCONTROLER-MASTER2.J3_6(MTMS/GPIO42) MICROCONTROLER-MASTER2.J3_7(MTDI/GPIO41) MICROCONTROLER-MASTER2.J3_8(MTDO/GPIO40) MICROCONTROLER-MASTER2.J3_9(MTCK/GPIO39) MICROCONTROLER-MASTER2.J3_10(GPIO38) MICROCONTROLER-MASTER2.J3_11(GPIO37) MICROCONTROLER-MASTER2.J3_12(GPIO36) MICROCONTROLER-MASTER2.J3_13(GPIO35) MICROCONTROLER-MASTER2.J3_14(GPIO0) MICROCONTROLER-MASTER2.J3_15(GPIO45) MICROCONTROLER-MASTER2.J3_16(GPIO48) MICROCONTROLER-MASTER2.J3_17(GPIO47) MICROCONTROLER-MASTER2.J3_18(GPIO21) MICROCONTROLER-MASTER2.J3_19(USB_D+/GPIO20) MICROCONTROLER-MASTER2.J3_20(USB_D-/GPIO19) MICROKONTROLER-DATALOGGER2.3V3 MICROKONTROLER-DATALOGGER2.D1 MICROKONTROLER-DATALOGGER2.D2 MICROKONTROLER-DATALOGGER2.D3 MICROKONTROLER-DATALOGGER2.D4 MICROKONTROLER-DATALOGGER2.D5 MICROKONTROLER-DATALOGGER2.D12 MICROKONTROLER-DATALOGGER2.D13 MICROKONTROLER-DATALOGGER2.D14 MICROKONTROLER-DATALOGGER2.D15 MICROKONTROLER-DATALOGGER2.D21 MICROKONTROLER-DATALOGGER2.D22 MICROKONTROLER-DATALOGGER2.D25 MICROKONTROLER-DATALOGGER2.D26 MICROKONTROLER-DATALOGGER2.D27 MICROKONTROLER-DATALOGGER2.D32 MICROKONTROLER-DATALOGGER2.D33 MICROKONTROLER-DATALOGGER2.D35 MICROKONTROLER-DATALOGGER2.EN MICROKONTROLER-DATALOGGER2.GND MICROKONTROLER-DATALOGGER2.VN MICROKONTROLER-DATALOGGER2.VP MUX1.1(X4) MUX1.2(X6) MUX1.4(X7) MUX1.5(X5) MUX1.12(X3) MUX1.13(X0) SUP.3 U2.1(CD) U$5.1(FC) U$5.6(LV) U$5.7(OSC) U$6.1(FC) U$6.6(LV) U$6.7(OSC)

## Notes on the sheet
- SLAVE-SpO2 | SLAVE-ECG
- ECG
- SpO2
- SL-2
- SL-1
- 21 MAY 2026 | 2
- 21 MAY 2026 | 1
- MASTER
- MASTER-UNIT | 21 MAY 2026
- 5
- BMS
- BMS | 21 MAY 2026 | SLAVE-NIBP
- 4
- NIBP
- SL-3
- 21 MAY 2026 | 3

## Power pins joined to a net without a drawn wire
3V: U2.7(3V)
3V3: ESP32-S3.J1_1(3V3) ESP_ANDIKA1.J1_1(3V3) ESP_OKA1.J1_1(3V3) MICROCONTROLER-MASTER2.J1_1(3V3)
3V3.: ESP32-S3-DEVKITC-1-N8R1.J1_2(3V3.) ESP32-S3.J1_2(3V3.) ESP_ANDIKA1.J1_2(3V3.) ESP_OKA1.J1_2(3V3.) MICROCONTROLER-MASTER2.J1_2(3V3.)
5V0: MICROCONTROLER-MASTER2.J1_21(5V0)
GND: ESP_ANDIKA1.J3_1(GND) ESP_OKA1.J3_1(GND) MICROCONTROLER-MASTER2.J3_1(GND)
GND1: ESP32-S3-DEVKITC-1-N8R1.J3_21(GND1) ESP32-S3.J3_21(GND1) ESP_ANDIKA1.J3_21(GND1) ESP_OKA1.J3_21(GND1) MICROCONTROLER-MASTER2.J3_21(GND1)
GND2: ESP32-S3-DEVKITC-1-N8R1.J3_22(GND2) ESP32-S3.J3_22(GND2) ESP_ANDIKA1.J3_22(GND2) ESP_OKA1.J3_22(GND2) MICROCONTROLER-MASTER2.J3_22(GND2)
GND3: ESP32-S3-DEVKITC-1-N8R1.J1_22(GND3) ESP32-S3.J1_22(GND3) MICROCONTROLER-MASTER2.J1_22(GND3)
V+: IC12.7(V+)
V-: IC12.4(V-)

## Library data of the parts
AC1*1 AC2*1 AC3 AC4 BASSIC2 BASSIC3 DC3 DC4 HPF2 HPF3 LPF5-LPF8 MC-1 NONINV2 NONINV3 NOTCH2 NOTCH3 SUP-RL = pinhead:PINHD-1X2: PIN HEADER
BOARD1 MICROKONTROLER-DATALOGGER2 = ESP32-DEVKITV1:ESP32DEVKITV1: https://github.com/shridattdudhat
C9-C12 C16 = rcl:CPOL-US: POLARIZED CAPACITOR, American symbol; SPICEPREFIX: C
C19 C23 C24 C27 = microbuilder:CAP_CERAMIC: Ceramic Capacitors 0402 - 0402 Surface Mount Capacitors 16pF 50V 5% [Digikey: 445-4899-2-ND] 18pF 50V 5% [Digikey: 490-1281-2-ND] 22pF 50V 5% [Digikey: 490-1283-2-ND] 68pF 50V 5% [Digikey: 490-1289-2-ND] 0.1uF 10V 10% [Digikey: 490-1318-2-ND] 1.0uF 6.3V 10% [Digikey: 490-1320-2-ND] 0603 - 0603 Surface Mount Capacitors 16 pF 50V 5% [Digikey: 445-5051-2-ND] 22 pF 50V [Digikey: PCC220ACVTR-ND] 33 pF 50V 5% [Digikey: 490-1415-1-ND] 56pF 50V 5% [Digikey: 490-1421-1-ND] 220pF 50V 5% [Digikey: 445-1285-1-ND] 680 pF 50V 2200 pF 50V 5% C0G [Digikey: 445-1297-1-ND] 5600 pF 100V 5% X7R [Digikey: 478-3711-1-ND] 0.1 µF 25V 10% [Digikey: PCC2277TR-ND] 0.22 µF 16V 10% X7R [Digikey: 445-1318-1-ND] 1.0 µF 25V 10% [Digikey: 445-5146-2-ND] 0603 - RF Specific 3pF 250V +/-0.1pF RF [Digikey: 712-1347-1-ND] 18 pF 250V 5% [Digikey: 478-3505-1-ND or 712-1322-1-ND] 56 pF 250V 5% C0G RF [Digikey: 490-4867-1-ND] 68 pF 250V RF [Digikey: 490-4868-1-ND] 0805 - 0805 Surface Mount Capacitors 220 pF 250V 2% RF Ceramic Capacitor [Digikey: 712-1398-1-ND] 1000 pF 50V 2% NP0 Ceramic Capacitor [Digikey: 478-3760-1-ND] 0.1 µF 25V 10% Ceramic Capacitor [Digikey: PCC1828TR-ND] 1.0 µF 16V 10% Ceramic Capacitor[Digikey: 490-1691-2-ND] 10.0 µF 10V 10% Ceramic Capacitor[Digikey: 709-1228-1-ND] 10.0 uF 16V 10% Ceramic Capacitor [Digikey: 478-5165-2-ND] 47 uF 6.3V 20% Ceramic Capacitor [Digikey: 587-1779-1-ND or 399-5506-1-ND] 1206 - 1206 Surface Mount Capacitors 47uF 10V 20% Ceramic Capacitor [Digikey: 490-5528-1-ND or 399-5508-1-ND or 445-6010-1-ND] 100uF 6.3V -20%, +80% Y5V Ceramic Capacitor (Digikey: 490-4512-1-ND, Mouser: 81-GRM31CF50J107ZE1L)
C25 C26 C30 C32-C37 C39 C41-C46 C58-C67 = rcl:C-EU: CAPACITOR, European symbol; SPICEPREFIX: C
C31 C38 C40 C47 C72-C75 = rcl:CPOL-EU: POLARIZED CAPACITOR, European symbol; SPICEPREFIX: C
D5 = diode:MBRS130LT3: Schottky Power Rectifier Source: http://www.onsemi.com/pub/Collateral/MBRS130LT3-D.PDF
D6-D9 = diode:DIODE-: DIODE
DS18B1 POWER1 SUPPLY121 X7 X8 X10 = con-molex:22-23-2031: .100" (2.54mm) Center Header - 3 Pin; MF: MOLEX; MPN: 22-23-2031; OC_FARNELL: 1462950; OC_NEWARK: 30C0862
ESP32-S3 ESP32-S3-DEVKITC-1-N8R1 ESP_ANDIKA1 ESP_OKA1 MICROCONTROLER-MASTER2 = ESP32-S3-DEVKITC-1-N8R8:ESP32-S3-DEVKITC-1-N8R8: Check availability <https://pricing.snapeda.com/parts/ESP32-S3-DEVKITC-1-N8R8/Espressif%20Systems/view-part?ref=eda>; AVAILABILITY: In Stock; CHECK_PRICES: https://www.snapeda.com/parts/ESP32-S3-DEVKITC-1-N8R8/Espressif+Systems/view-part/?ref=eda; DESCRIPTION: The ESP32-S3-DEVKITC-1-N8R8 from Espressif Systems is a development board designed for RF, RFID, and wireless applications. It supports 802.11 b/g/n Wi-Fi and Bluetooth® 5.x (BLE) connectivity at 2.4GHz, making it ideal for IoT and wireless communication projects. This board is powered by the ESP32-S3-WROOM-1-N8R8 module, which features 8MB Quad SPI Flash and 8MB Octal SPI for efficient memory storage and processing.; MF: Espressif Systems; MP: ESP32-S3-DEVKITC-1-N8R8; PACKAGE: None; PRICE: None; PURCHASE-URL: https://www.snapeda.com/api/url_track_click_mouser/?unipart_id=8940048&manufacturer=Espressif Systems&part_name=ESP32-S3-DEVKITC-1-N8R8&search_term=esp32 s3; SNAPEDA_LINK: https://www.snapeda.com/parts/ESP32-S3-DEVKITC-1-N8R8/Espressif+Systems/view-part/?ref=snap
F3 F4 = pinhead:PINHD-1X5: PIN HEADER
FB3 FB4 = microbuilder:FERRITE: Ferrite Bead 0603 MMZ1608B121C - 120 Ohm @ 100MHz, 600mA, 0.15 Ohm DC Resistance - Digikey: 445-2164-1-ND BK1608HW121-T - 120 Ohm, 600mA Ferrite Chip - Digikey: 587-1876-2-ND 0805 HZ0805B272R-10 - 2.7K Ohm @ 100MHz, 200mA, 0.8 Ohm DC Resistance - Digikey: 240-2504-1-ND (see also Murata BLM21BD272SN1L) MMZ2012Y152B - 1.5K Ohm @ 100MHz, 500mA, 0.4 Ohm DC Resistance - Digikey: 445-1560-1-ND - Mainly for high frequency (80-400MHz) MMZ2012R102A - 1K Ohm @ 100MHz, 500mA, 0.3 Ohm DC Resistance - Digikey: 445-1555-2-ND - More general purpose (10-200MHz)
HX710B = hx710b:HX710B
IC7 = optocoupler:SFH6156: 5.3 kV TRIOS High Reliability Optocoupler; MF: VISHAY/TELEFUNKEN; MPN: SFH6156-4T; OC_FARNELL: 1612479; OC_NEWARK: 21H7733
IC8 = MPS-3117-006GC:MPS-3117-006GC: MPS-3110 series Pressure Sensor Source: Datasheet; DESCRIPTION: MPS-3110 series Pressure Sensor; HEIGHT: 10mm; MANUFACTURER_NAME: Metrodyne Microsystem Corp; MANUFACTURER_PART_NUMBER: MPS-3117-006GC
IC11 IC14 = analog-devices:AD620: Low Cost, Low Power, Instrumentation Amplifier Source: http://www.analog.com/UploadedFiles/Data_Sheets/37793330023930AD620_e.pdf; MF: ALTERA CORPORATION; MPN: AD620AN; OC_FARNELL: 1523782; OC_NEWARK: 05F7108
IC12 IC15 IC17 IC18 = linear:OP07*: OP AMP
IC13 IC16 = ihpcb-tl084:TL084: OPAMP
IC22 IC23 = linear:TL084: OP AMP
IC24 = linear:TL072: OP AMP
IC29-IC32 = linear:78*: Positive VOLTAGE REGULATOR Source: http://cache.national.com/ds/LM/LM78L05.pdf http://www.fairchildsemi.com/ds/LM/LM7805.pdf
JP2 = microbuilder:HEADER-1X3: PIN HEADER
K4 = relay:ZF112: RELAY 1 x switch; OC_FARNELL: unknown; OC_NEWARK: unknown
LED1 LED2 LED4 = adafruit:LED: LED OSRAM: - CHIPLED LG R971, LG N971, LY N971, LG Q971, LY Q971, LO R971, LY R971 LH N974, LH R974 LS Q976, LO Q976, LY Q976 LO Q996 - Hyper CHIPLED LW Q18S LB Q993, LB Q99A, LB R99A - SideLED LS A670, LO A670, LY A670, LG A670, LP A670 LB A673, LV A673, LT A673, LW A673 LH A674 LY A675 LS A676, LA A676, LO A676, LY A676, LW A676 LS A679, LY A679, LG A679 - Hyper Micro SIDELED® LS Y876, LA Y876, LO Y876, LY Y876 LT Y87S - SmartLED LW L88C, LW L88S LB L89C, LB L89S, LG L890 LS L89K, LO L89K, LY L89K LS L896, LA L896, LO L896, LY L896 - TOPLED LS T670, LO T670, LY T670, LG T670, LP T670 LSG T670, LSP T670, LSY T670, LOP T670, LYG T670 LG T671, LOG T671, LSG T671 LB T673, LV T673, LT T673, LW T673 LH T674 LS T676, LA T676, LO T676, LY T676, LB T676, LH T676, LSB T676, LW T676 LB T67C, LV T67C, LT T67C, LS T67K, LO T67K, LY T67K, LW E67C LS E67B, LA E67B, LO E67B, LY E67B, LB E67C, LV E67C, LT E67C LW T67C LS T679, LY T679, LG T679 LS T770, LO T770, LY T770, LG T770, LP T770 LB T773, LV T773, LT T773, LW T773 LH T774 LS E675, LA E675, LY E675, LS T675 LS T776, LA T776, LO T776, LY T776, LB T776 LHGB T686 LT T68C, LB T68C - Hyper Mini TOPLED® LB M676 - Mini TOPLED Santana® LG M470 LS M47K, LO M47K, LY M47K Source: http://www.osram.convergy.de/
M1 = motor:308-100: Pico Vibe 8mm Vibration Motor - 3mm Type; PRECISION_MICRODRIVES: 308-100
MORNSUNDC-DC = RFM-0505S:RFM-0505S: Check availability <https://pricing.snapeda.com/parts/RFM-0505S/Recom%20Power/view-part?ref=eda>; AVAILABILITY: In Stock; CHECK_PRICES: https://www.snapeda.com/parts/RFM-0505S/Recom+Power/view-part/?ref=eda; DESCRIPTION: DC-DC Converter, SIP4, 1kV unreg, Single Output, 1W, 5V Out, RFM Series | RECOM Power Inc. RFM-0505S; MF: Recom Power; MP: RFM-0505S; PACKAGE: SIP-4 Recom Power; PRICE: None; SNAPEDA_LINK: https://www.snapeda.com/parts/RFM-0505S/Recom+Power/view-part/?ref=snap
MUX1 = 40xx:4051: 8-channel ANALOG MULTIPLEXER
NELLCOR1 NEX = con-molex:22-23-2041: .100" (2.54mm) Center Header - 4 Pin; MF: MOLEX; MPN: 22-23-2041; OC_FARNELL: 1462920; OC_NEWARK: 38C0355
OUT1 X9 = con-molex:22-23-2021: .100" (2.54mm) Center Header - 2 Pin; MF: MOLEX; MPN: 22-23-2021; OC_FARNELL: 1462926; OC_NEWARK: 25C3832
OUT-SENSOR3 = con-lstb:MA04-1: PIN HEADER; OC_FARNELL: unknown; OC_NEWARK: unknown
Q1 Q3 Q6 Q9 = AOD4184A:AOD4184A: Check availability <https://pricing.snapeda.com/parts/AOD4184A/Alpha%20%26/view-part?ref=eda>; AVAILABILITY: In Stock; CHECK_PRICES: https://www.snapeda.com/parts/AOD4184A/Alpha/view-part/?ref=eda; DESCRIPTION: N-Channel 40V 13A (Ta), 50A (Tc) 2.3W (Ta), 50W (Tc) Surface Mount TO-252, (D-Pak); MF: Alpha &; MP: AOD4184A; PACKAGE: TO-252 Alpha &amp; Omega Semiconductor; PRICE: None; SNAPEDA_LINK: https://www.snapeda.com/parts/AOD4184A/Alpha/view-part/?ref=snap
Q2 = microbuilder:ELECTRET: Electret microphone Thru hole 2.54mm spacing with 9.7mm diameter
Q5 = transistor-power:BD139: NPN TRANSISTOR
Q11 Q12 = 2SC5200:2SC5200: Check availability <https://pricing.snapeda.com/parts/2SC5200/STMicroelectronics/view-part?ref=eda>; AVAILABILITY: In Stock; CHECK_PRICES: https://www.snapeda.com/parts/2SC5200/STMicroelectronics/view-part/?ref=eda; DESCRIPTION: Bipolar (BJT) Transistor NPN 230 V 15 A 30MHz 150 W Through Hole TO-264; MF: STMicroelectronics; MP: 2SC5200; PACKAGE: TO-264-3 STMicroelectronics; PRICE: None; SNAPEDA_LINK: https://www.snapeda.com/parts/2SC5200/STMicroelectronics/view-part/?ref=snap
Q13-Q15 = transistor-power:TIP41C: NPN TRANSISTOR
R1-R9 R29-R32 R39 R40 R58-R72 R74-R88 R90-R93 R115-R135 R140-R143 RDS1 = rcl:R-EU_: RESISTOR, European symbol; SPICEPREFIX: R
R33-R38 = microbuilder:RESISTOR: Resistors 0402 - 0402 Surface Mount Package 22 Ohm 1% 1/16W [Digikey: 311-22.0LRTR-ND] 33 Ohm 5% 1/16W 1.0K 5% 1/16W 1.5K 5% 1/16W 2.0K 1% 1/16W 10.0K 1% 1/16W [Digikey: 311-10.0KLRTR-ND] 10.0K 5% 1/16W [Digikey: RMCF0402JT10K0TR-ND] 12.1K 1% 1/16W [Digikey: 311-22.0LRTR-ND] 100.0K 5% 1/16W 0603 - 0603 Surface Mount Package 0 Ohm 1/10 Watt 1% Resistor 15 Ohm 1/10 Watt 1% Resistor 33 Ohm 1/10 Watt 1% Resistor 49.9 Ohm 1/10 Watt 1% Resistor 100 Ohm 1/10 Watt 1% Resistor 150 Ohm 1/10 Watt 1% Resistor 240 Ohm 1/10 Watt 1% Resistor 390 Ohm 1/10 Watt 1% Resistor 560 Ohm 1/10 Watt 1% Resistor 680 Ohm 1/10 Watt 1% Resistor 750 Ohm 1/10 Watt 1% Resistor 1.0K Ohm 1/10 Watt 1% Resistor 1.5K Ohm 1/10 Watt 1% Resistor 2.0K Ohm 1/10 Watt 1% Resistor 2.2K Ohm 1/10 Watt 1% Resistor 3.3K Ohm 1/10 Watt 1% Resistor 4.7K Ohm 1/10 Watt 1% Resistor 10.0K Ohm 1/10 Watt 1% Resistor 12.0K Ohm 1/10 Watt 1% Resistor 12.1K Ohm 1/10 Watt 1% Resistor 20.0K Ohm 1/10 Watt 1% Resistor 33.0K Ohm 1/10 Watt 1% Resistor 100.0K Ohm 1/10 Watt 1% Resistor 0805 - 0805 Surface Mount Package 0 Ohm 1/8 Watt 1% Resistor 33 Ohm 1/8 Watt 1% Resistor 100 Ohm 1/8 Watt 1% Resistor 150 Ohm 1/8 Watt 1% Resistor 200 Ohm 1/8 Watt 1% Resistor 240 Ohm 1/8 Watt 1% Resistor 330 Ohm 1/8 Watt 1% Resistor 390 Ohm 1/8 Watt 1% Resistor 470 Ohm 1/8 Watt 1% Resistor 1.0K Ohm 1/8 Watt 1% Resistor 1.5K Ohm 1/8 Watt 1% Resistor 2.0K Ohm 1/8 Watt 1% Resistor 4.7K Ohm 1/8 Watt 1% Resistor 5.1K Ohm 1/8 Watt 1% Resistor 5.6K Ohm 1/8 Watt 1% Resistor 10.0K Ohm 1/8 Watt 1% Resistor 22.0K Ohm 1/8 Watt 1% Resistor 33.0K Ohm 1/8 Watt 1% Resistor 100K Ohm 1/8 Watt 1% Resistor 1206 - 1206 Surface Mount Package 2012 - 2010 Surface Mount Package 0.11 Ohm 1/2 Watt 1% Resistor - Digikey: RHM.11UCT-ND
R73 R89 = pot:TRIM_EU-: POTENTIOMETER
SUP = pinhead:PINHD-1X3: PIN HEADER
U1 U3 = AMS1117-3.3:AMS1117-3.3: Check availability <https://pricing.snapeda.com/parts/AMS1117-3.3/Advanced%20Monolithic%20Systems/view-part?ref=eda>; AVAILABILITY: Not in stock; CHECK_PRICES: https://www.snapeda.com/parts/AMS1117-3.3/Advanced+Monolithic+Systems/view-part/?ref=eda; DESCRIPTION: Sot223/Pkg 1-Amp 3.3-Volt Low Drop Out Voltage Regulatator; MF: Advanced Monolithic Systems; MP: AMS1117-3.3; PACKAGE: SOT-223 Seeed Technology; PRICE: None; SNAPEDA_LINK: https://www.snapeda.com/parts/AMS1117-3.3/Advanced+Monolithic+Systems/view-part/?ref=snap
U2 = 254:254: Check availability <https://pricing.snapeda.com/parts/254/Adafruit/view-part?ref=eda>; AVAILABILITY: In Stock; CHECK_PRICES: https://www.snapeda.com/parts/254/Adafruit+Industries/view-part/?ref=eda; DESCRIPTION: MicroSD card breakout board+ | Adafruit Industries 254; MF: Adafruit; MP: 254; PACKAGE: NON STANDARD Adafruit; PRICE: None; SNAPEDA_LINK: https://www.snapeda.com/parts/254/Adafruit+Industries/view-part/?ref=snap
U5 = microbuilder:MAX4466: MAX4466 - Microphone Pre-Amp
U$2 = SparkFun-LED:LED-TRICOLOR: Tri-Color LED SMD Proven layout and schematic for triple color LED in SMD package - common anode. Spark Fun Electronics SKU : COM-07844
U$5 U$6 = MAX660:MAX660: Check availability <https://pricing.snapeda.com/parts/MAX660/Texas%20Instruments/view-part?ref=eda>; AVAILABILITY: Not in stock; CHECK_PRICES: https://www.snapeda.com/parts/MAX660/Texas+Instruments/view-part/?ref=eda; DESCRIPTION: Charge Pump Switching Regulator IC Positive or Negative Fixed -Vin, 2Vin 1 Output 100mA 8-SOIC (0.154, 3.90mm Width); MF: Texas Instruments; MP: MAX660; PACKAGE: None; PRICE: None; SNAPEDA_LINK: https://www.snapeda.com/parts/MAX660/Texas+Instruments/view-part/?ref=snap
VR2 = microbuilder:TRIMPOT: 3-Pin SMT Trimpots Bourns TC33 (X-2) Series 10K - Digikey: TC33X-2-103E 100K - Digikey: TC33X-104ECT-ND Bourns 3303 (W) Series 3mm 10K Single Turn - Digikey: 3303W-103ETR-ND 3mm 100K Single Turn - Digikey: 3303X-104ETR-ND
X2 = con-molex:22-23-2051: .100" (2.54mm) Center Header - 5 Pin; MF: MOLEX; MPN: 22-23-2051; OC_FARNELL: 1462952; OC_NEWARK: 38C9178